# EAGLE design SRB (EAGLE 8.0.0)
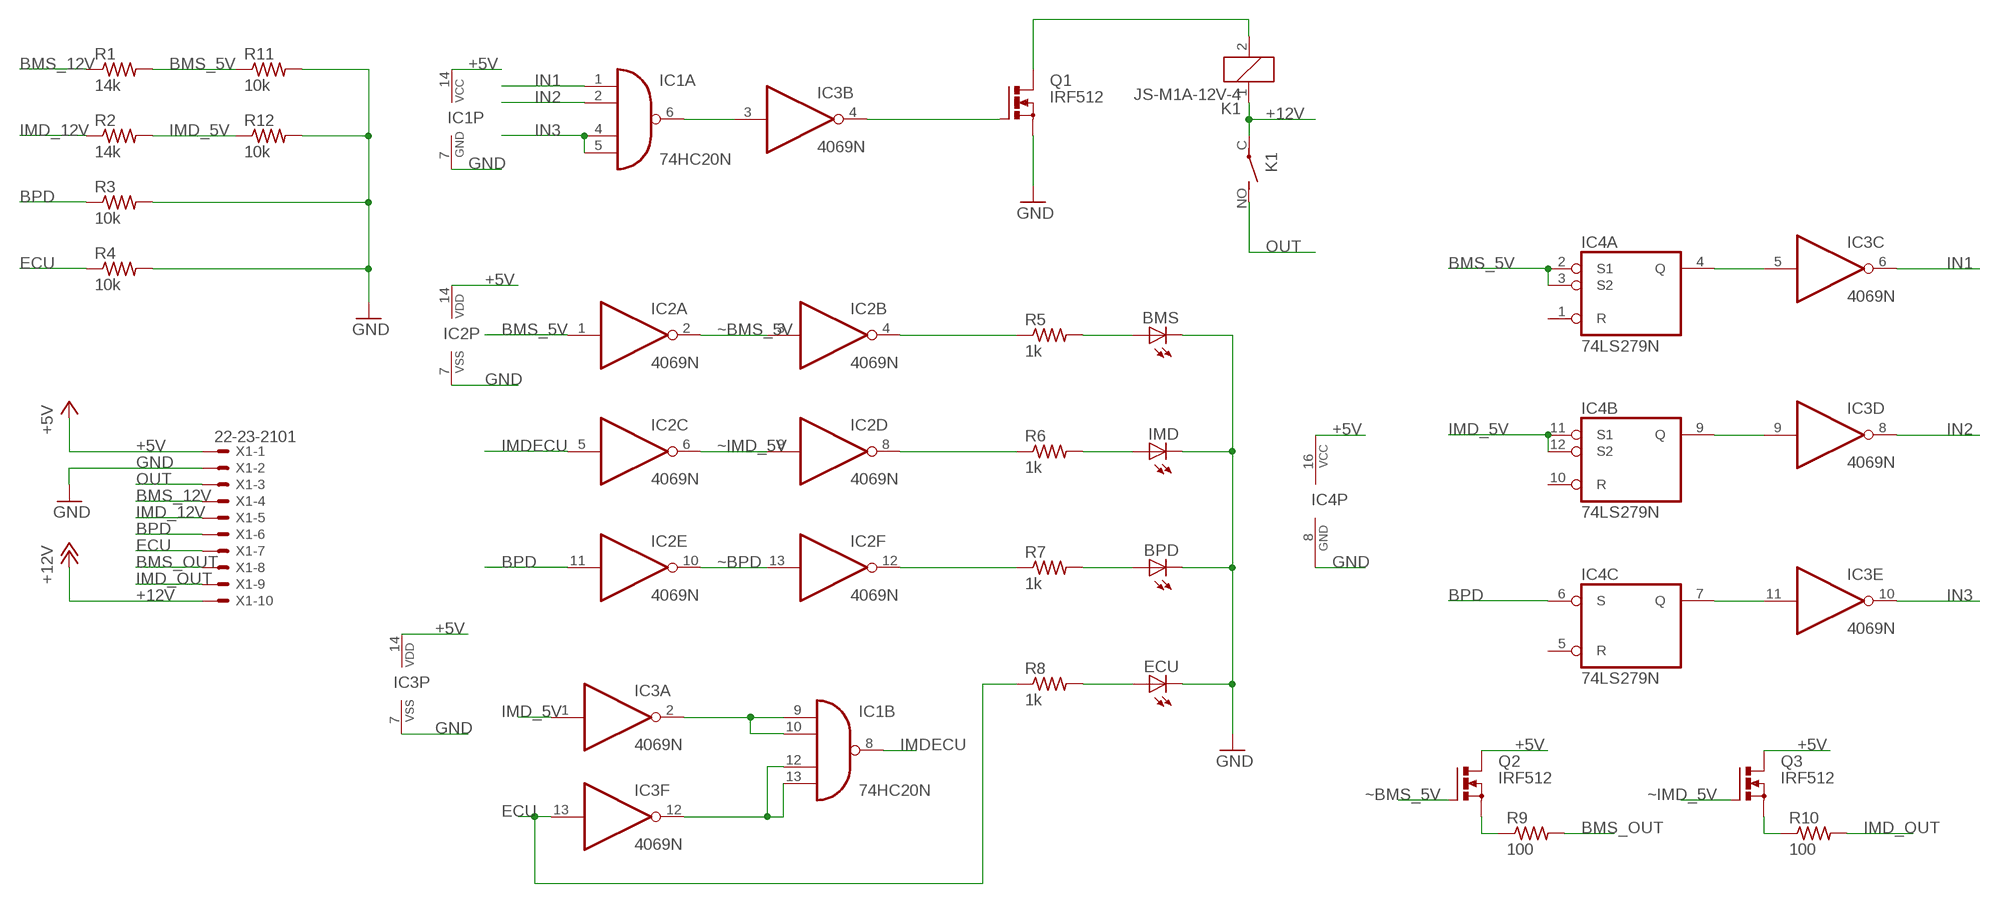
[diagram p0: schematic, sheet 1]

## Parts
BMS  LED5MM  [LED5MM]
BPD  LED5MM  [LED5MM]
ECU  LED5MM  [LED5MM]
IC1  74HC20N  [DIL14]
IC2  4069N  [DIL14]
IC3  4069N  [DIL14]
IC4  74LS279N  [DIL16]
IMD  LED5MM  [LED5MM]
K1  JS-M1A-12V-4  [JS-M1A]
Q1  IRF512  [TO220BV]
Q2  IRF512  [TO220BV]
Q3  IRF512  [TO220BV]
R1  14k  R-US_0207/10  [0207/10]
R2  14k  R-US_0207/10  [0207/10]
R3  10k  R-US_0207/10  [0207/10]
R4  10k  R-US_0207/10  [0207/10]
R5  1k  R-US_0207/10  [0207/10]
R6  1k  R-US_0207/10  [0207/10]
R7  1k  R-US_0207/10  [0207/10]
R8  1k  R-US_0207/10  [0207/10]
R9  100  R-US_0207/10  [0207/10]
R10  100  R-US_0207/10  [0207/10]
R11  10k  R-US_0207/10  [0207/10]
R12  10k  R-US_0207/10  [0207/10]
X1  22-23-2101  [22-23-2101]

## Nets
+5V: IC1.14(P:VCC) IC2.14(P:VDD) IC3.14(P:VDD) IC4.16(P:VCC) Q2.D Q3.D X1.1
+12V: K1.1 K1.C(2:P) X1.10
BMS_5V: IC2.1(A:I) IC4.2(A:S1) IC4.3(A:S2) R1.2 R11.1
BMS_12V: R1.1 X1.4
BMS_OUT: R9.2 X1.8
BPD: IC2.11(E:I) IC4.6(C:S) R3.1 X1.6
ECU: IC3.13(F:I) R4.1 R8.1 X1.7
GND: BMS.K(C) BPD.K(C) ECU.K(C) IC1.7(P:GND) IC2.7(P:VSS) IC3.7(P:VSS) IC4.8(P:GND) IMD.K(C) Q1.S R3.2 R4.2 R11.2 R12.2 X1.2
IMD_5V: IC3.1(A:I) IC4.11(B:S1) IC4.12(B:S2) R2.2 R12.1
IMD_12V: R2.1 X1.5
IMD_OUT: R10.2 X1.9
IMDECU: IC1.8(B:O) IC2.5(C:I)
IN1: IC1.1(A:I0) IC3.6(C:O)
IN2: IC1.2(A:I1) IC3.8(D:O)
IN3: IC1.4(A:I2) IC1.5(A:I3) IC3.10(E:O)
N$1: IC1.6(A:O) IC3.3(B:I)
N$2: IC3.4(B:O) Q1.G
N$3: Q2.S R9.1
N$4: IC2.4(B:O) R5.1
N$5: IC2.8(D:O) R6.1
N$6: IC2.12(F:O) R7.1
N$7: IC1.12(B:I2) IC1.13(B:I3) IC3.12(F:O)
N$10: IC1.9(B:I0) IC1.10(B:I1) IC3.2(A:O)
N$12: BMS.A R5.2
N$13: IMD.A R6.2
N$14: BPD.A R7.2
N$15: ECU.A R8.2
N$16: Q3.S R10.1
N$17: K1.2 Q1.D
N$18: IC3.5(C:I) IC4.4(A:Q)
N$19: IC3.9(D:I) IC4.9(B:Q)
N$20: IC3.11(E:I) IC4.7(C:Q)
OUT: K1.NO(2:S) X1.3
~BMS_5V: IC2.2(A:O) IC2.3(B:I) Q2.G
~BPD: IC2.10(E:O) IC2.13(F:I)
~IMD_5V: IC2.6(C:O) IC2.9(D:I) Q3.G
Unconnected: IC4.1(A:R) IC4.5(C:R) IC4.10(B:R) IC4.13(D:Q) IC4.14(D:R) IC4.15(D:S)

## Library data of the parts
BMS BPD ECU IMD = led:LED: LED OSRAM: - CHIPLED LG R971, LG N971, LY N971, LG Q971, LY Q971, LO R971, LY R971 LH N974, LH R974 LS Q976, LO Q976, LY Q976 LO Q996 - Hyper CHIPLED LW Q18S LB Q993, LB Q99A, LB R99A - SideLED LS A670, LO A670, LY A670, LG A670, LP A670 LB A673, LV A673, LT A673, LW A673 LH A674 LY A675 LS A676, LA A676, LO A676, LY A676, LW A676 LS A679, LY A679, LG A679 - Hyper Micro SIDELED® LS Y876, LA Y876, LO Y876, LY Y876 LT Y87S - SmartLED LW L88C, LW L88S LB L89C, LB L89S, LG L890 LS L89K, LO L89K, LY L89K LS L896, LA L896, LO L896, LY L896 - TOPLED LS T670, LO T670, LY T670, LG T670, LP T670 LSG T670, LSP T670, LSY T670, LOP T670, LYG T670 LG T671, LOG T671, LSG T671 LB T673, LV T673, LT T673, LW T673 LH T674 LS T676, LA T676, LO T676, LY T676, LB T676, LH T676, LSB T676, LW T676 LB T67C, LV T67C, LT T67C, LS T67K, LO T67K, LY T67K, LW E67C LS E67B, LA E67B, LO E67B, LY E67B, LB E67C, LV E67C, LT E67C LW T67C LS T679, LY T679, LG T679 LS T770, LO T770, LY T770, LG T770, LP T770 LB T773, LV T773, LT T773, LW T773 LH T774 LS E675, LA E675, LY E675, LS T675 LS T776, LA T776, LO T776, LY T776, LB T776 LHGB T686 LT T68C, LB T68C - Hyper Mini TOPLED® LB M676 - Mini TOPLED Santana® LG M470 LS M47K, LO M47K, LY M47K Source: http://www.osram.convergy.de LUXEON: - LUMILED® LXK2-PW12-R00, LXK2-PW12-S00, LXK2-PW14-U00, LXK2-PW14-V00 LXK2-PM12-R00, LXK2-PM12-S00, LXK2-PM14-U00 LXK2-PE12-Q00, LXK2-PE12-R00, LXK2-PE12-S00, LXK2-PE14-T00, LXK2-PE14-U00 LXK2-PB12-K00, LXK2-PB12-L00, LXK2-PB12-M00, LXK2-PB14-N00, LXK2-PB14-P00, LXK2-PB14-Q00 LXK2-PR12-L00, LXK2-PR12-M00, LXK2-PR14-Q00, LXK2-PR14-R00 LXK2-PD12-Q00, LXK2-PD12-R00, LXK2-PD12-S00 LXK2-PH12-R00, LXK2-PH12-S00 LXK2-PL12-P00, LXK2-PL12-Q00, LXK2-PL12-R00 Source: www.luxeon.com KINGBRIGHT: KA-3528ASYC Source: www.kingbright.com
IC1 = 74xx-eu:74*20: Dual 4-input NAND gate
IC2 IC3 = 40xx:4069: Hex INVERTER
IC4 = 74xx-us:74*279: Quadruple S-R LATCH
K1 = relay:JS-M1A*: Automotive Ultra-Miniature Power Relay NAiS Source: http://www.mew-europe.com/.. en_ds_61211_0000.pdf; MPN: JSM1A-12V-4; OC_FARNELL: unknown; OC_NEWARK: 13P4554
Q1-Q3 = transistor-power:IRF512: N-CHANNEL MOS FET
R1-R12 = resistor:R-US_: RESISTOR, American symbol
X1 = con-molex:22-23-2101: .100" (2.54mm) Center Header - 10 Pin; MF: MOLEX; MPN: 22-23-2101; OC_FARNELL: 1756828; OC_NEWARK: 94C0765

## Board
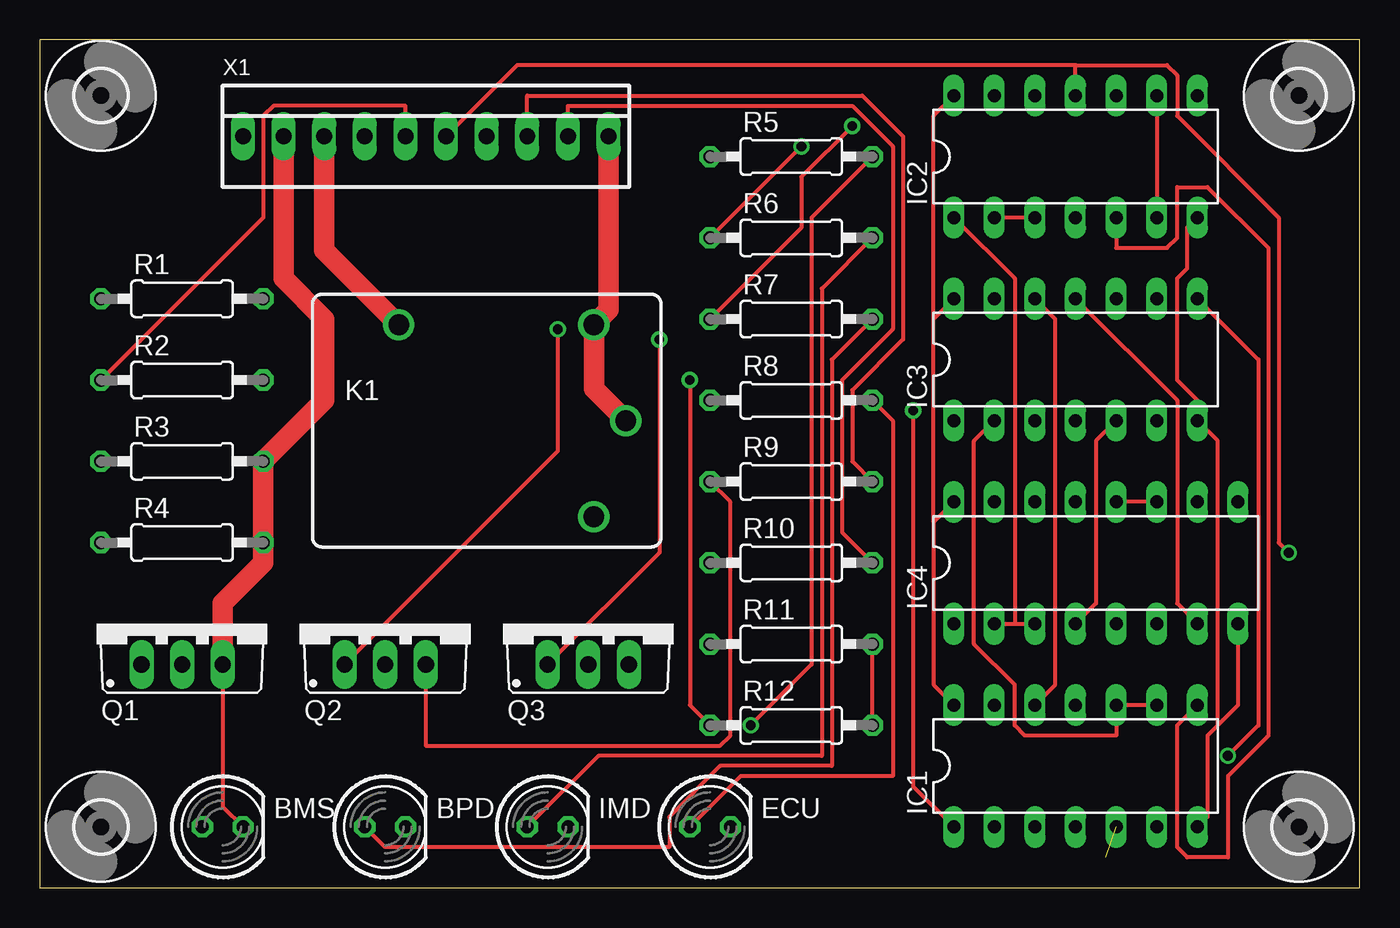
[diagram p1: board, top side]
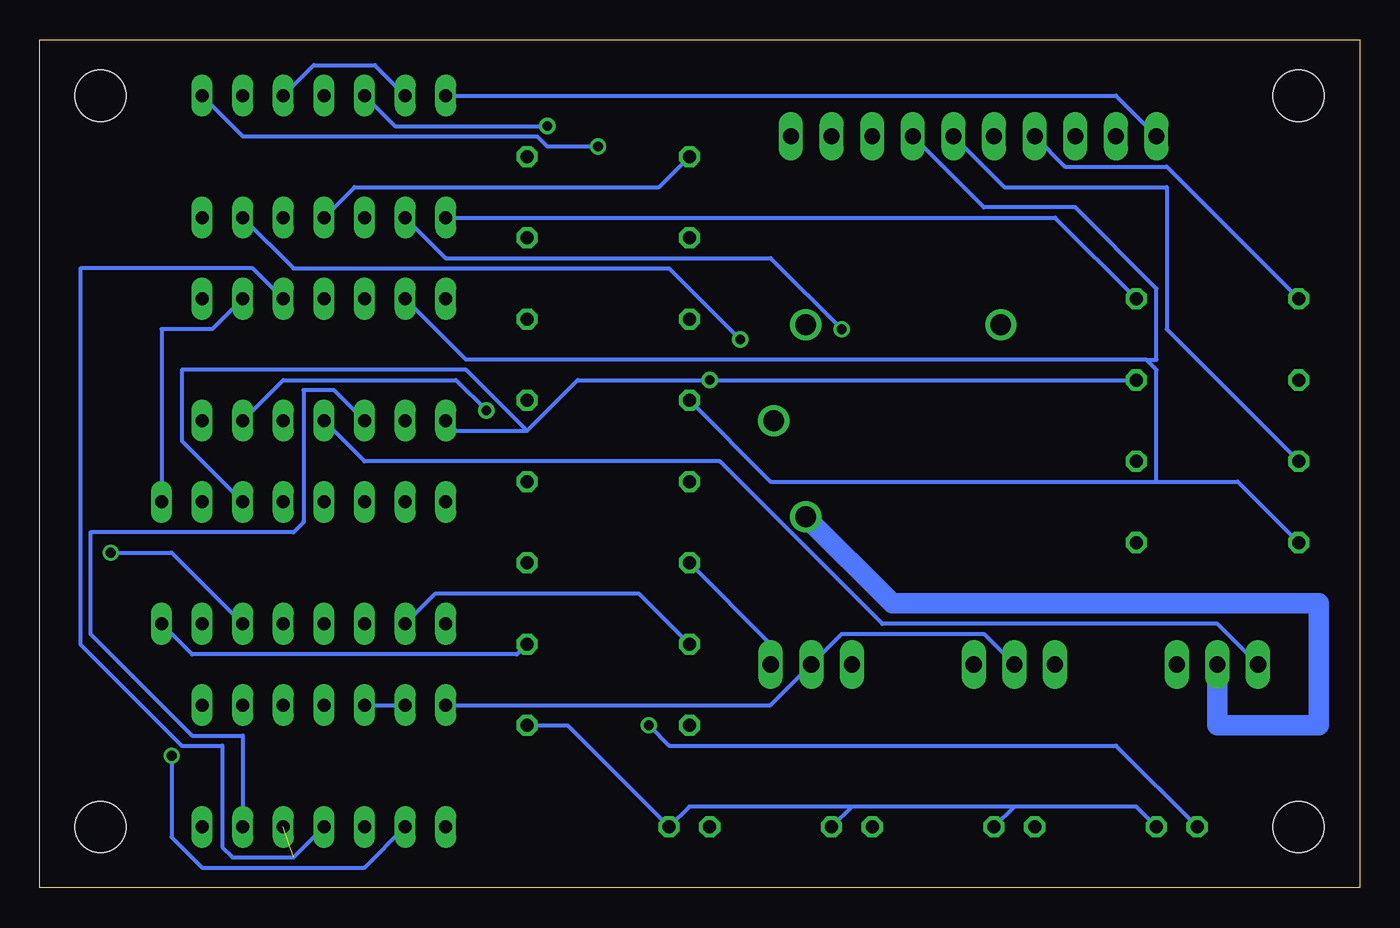
[diagram p2: board, bottom side, seen from below]

Size 82.53 x 53.01 mm. Coordinates in mm from the lower left corner, seen from the top.
Outline: 0,0 82.53,0 82.53,53.01 0,53.01 0,0
Copper layers (1*16): Top 0.035mm / dielectric 1.5mm / Bottom 0.035mm
Design rules "default": minimum track width 10mil, minimum drill 24mil, track to track 8mil, track to pad 8mil, pad to pad 8mil, via to via 8mil, smd to smd 8mil, copper to edge 40mil, drill to drill 8mil, minimum pad ring 10mil, minimum via ring 8mil, stop-mask expansion 4mil, vias tented up to drill 0mil, thermal gap 10mil

### Footprints (pad centres in the part's own frame; a part is rotated, then mirrored left to right if it is on the bottom)
LED5MM = drill 0.813 octagon: A -1.27,0; K 1.27,0
DIL14 = drill 0.813 long: 1 -7.62,-3.81; 2 -5.08,-3.81; 3 -2.54,-3.81; 4 0,-3.81; 5 2.54,-3.81; 6 5.08,-3.81; 7 7.62,-3.81; 8 7.62,3.81; 9 5.08,3.81; 10 2.54,3.81; 11 0,3.81; 12 -2.54,3.81; 13 -5.08,3.81; 14 -7.62,3.81
DIL16 = drill 0.813 long: 1 -8.89,-3.81; 2 -6.35,-3.81; 3 -3.81,-3.81; 4 -1.27,-3.81; 5 1.27,-3.81; 6 3.81,-3.81; 7 6.35,-3.81; 8 8.89,-3.81; 9 8.89,3.81; 10 6.35,3.81; 11 3.81,3.81; 12 1.27,3.81; 13 -1.27,3.81; 14 -3.81,3.81; 15 -6.35,3.81; 16 -8.89,3.81
JS-M1A = drill 1.3: 1 6.7,6; 2 6.7,-6; C 8.7,0; NO -5.5,6
TO220BV = drill 1.016 long: D 0,-2.54; G -2.54,-2.54; S 2.54,-2.54
0207/10 = drill 0.813 octagon: 1 -5.08,0; 2 5.08,0
3,2 = hole 3.2: 0,0
22-23-2101 = drill 1 long: 1 -11.43,0; 2 -8.89,0; 3 -6.35,0; 4 -3.81,0; 5 -1.27,0; 6 1.27,0; 7 3.81,0; 8 6.35,0; 9 8.89,0; 10 11.43,0

### Placement (x,y rotation side)
BMS  11.43,3.81 0 top
BPD  21.59,3.81 0 top
ECU  41.91,3.81 0 top
IC1  64.77,7.62 0 top
IC2  64.77,45.72 0 top
IC3  64.77,33.02 0 top
IC4  66.04,20.32 0 top
IMD  31.75,3.81 0 top
K1  27.94,29.21 0 top
Q1  8.89,16.51 0 top
Q2  21.59,16.51 0 top
Q3  34.29,16.51 0 top
R1  8.89,36.83 0 top
R2  8.89,31.75 0 top
R3  8.89,26.67 0 top
R4  8.89,21.59 0 top
R5  46.99,45.72 0 top
R6  46.99,40.64 0 top
R7  46.99,35.56 0 top
R8  46.99,30.48 0 top
R9  46.99,25.4 0 top
R10  46.99,20.32 0 top
R11  46.99,15.24 0 top
R12  46.99,10.16 0 top
U$1  [3,2]  3.81,3.81 0 top
U$2  [3,2]  3.81,49.53 0 top
U$3  [3,2]  78.74,49.53 0 top
U$4  [3,2]  78.74,3.81 0 top
X1  24.13,46.99 0 top

### Tracks (layer width: path | path; a pad name or v marks a point on that pad's centre or on a via)
+5V
  Top 0.254: IC1.14 55.88,12.7 55.88,22.86 | IC4.16 55.88,22.86 | 55.88,35.56 IC3.14 | 55.88,22.86 55.88,35.56 | IC2.14 55.88,48.26 55.88,35.56
  Bottom 0.254: Q2.D 23.5,15.88 32.38,15.88 Q3.D 36.83,11.43 IC1.14 | X1.1 15.24,49.53 IC2.14
+12V
  Top 1.27: X1.10 35.56,36.13 K1.1 34.64,31.21 K1.C
BMS_5V
  Top 0.254: IC4.2 60.96,16.51 | 60.96,16.51 IC4.3 | 60.96,16.51 60.96,38.1 IC2.1
  Bottom 0.254: R11.1 45.09,18.41 57.78,18.41 IC4.2 | R1.2 19.05,41.91 IC2.1
BMS_12V
  Bottom 0.254: R1.1 12.06,45.09 18.41,45.09 X1.4
BMS_OUT
  Top 0.254: R9.2 50.8,26.67 50.8,31.11 53.98,34.29 53.98,46.99 51.44,49.53 30.48,49.53 X1.8
BPD  (via drill 0.61)
  Top 0.254: v78.11,20.95 77.47,21.59 77.47,41.91 71.12,48.26 71.12,50.8 70.48,51.44 64.77,51.44 | IC2.11 64.77,51.44 | X1.6 29.84,51.44 64.77,51.44
  Bottom 0.254: R3.1 12.06,34.92 12.06,43.81 22.23,43.81 X1.6 | IC4.6 74.3,20.95 v78.11,20.95
ECU
  Bottom 0.254: R4.1 7.62,25.4 12.7,25.4 | 12.7,25.4 36.83,25.4 R8.1 | IC3.13 55.88,33.02 13.34,33.02 | 13.34,33.02 12.7,32.38 12.7,25.4 | X1.7 23.5,42.55 17.78,42.55 12.7,37.47 12.7,33.02 13.34,33.02
GND
  Top 0.254: IC1.7 73.03,4.45 73.03,9.53 73.66,10.16 | 73.66,10.16 74.93,11.43 IC4.8 | 73.66,10.16 73.66,27.94 IC3.7 72.39,30.48 71.12,31.75 71.12,38.1 71.75,38.73 71.75,41.27 IC2.7 | R12.2 R11.2 | BMS.K 11.43,5.08 Q1.S
  Top 1.27: X1.2 15.24,38.1 17.78,35.56 17.78,30.48 R3.2 R4.2 13.97,20.32 11.43,17.78 Q1.S
  Bottom 0.254: R12.2 49.53,10.16 ECU.K 41.91,5.08 31.75,5.08 | 21.59,5.08 BPD.K | 21.59,5.08 13.97,5.08 BMS.K | 31.75,5.08 IMD.K | 21.59,5.08 31.75,5.08 | IC4.8 73.03,14.61 52.7,14.61 R11.2
IMD_5V  (via drill 0.61)
  Top 0.254: IC4.11 IC4.12 | R12.1 40.64,11.43 v40.64,31.75
  Bottom 0.254: R2.2 v40.64,31.75 48.9,31.75 52.07,28.57 | 52.07,28.57 56.52,28.57 IC3.1 | IC4.11 73.66,27.94 73.66,32.38 55.88,32.38 52.07,28.57
IMD_12V
  Top 0.254: R2.1 13.97,41.91 13.97,48.26 14.61,48.9 22.86,48.9 X1.5
IMD_OUT
  Top 0.254: R10.2 50.16,22.23 50.16,31.75 53.34,34.92 53.34,46.35 50.8,48.9 33.02,48.9 X1.9
IMDECU
  Top 0.254: IC1.8 71.12,10.16 71.12,2.54 71.75,1.91 74.3,1.91 74.3,6.99 76.83,9.53 76.83,40.01 73.03,43.81 71.12,43.81 71.12,40.64 70.48,40.01 67.31,40.01 IC2.5
IN1  (via drill 0.61)
  Top 0.254: IC1.1 54.61,6.35 v54.61,29.84
  Bottom 0.254: v54.61,29.84 56.52,31.75 67.31,31.75 IC3.6
IN2  (via drill 0.61)
  Top 0.254: v74.3,8.26 76.2,10.16 76.2,33.02 IC3.8
  Bottom 0.254: IC1.2 62.23,1.27 72.39,1.27 74.3,3.17 v74.3,8.26
IN3  (1 unrouted)
  Bottom 0.254: IC1.4 66.67,1.91 70.48,1.91 71.12,2.54 71.12,8.89 73.66,8.89 80.01,15.24 80.01,38.73 69.22,38.73 IC3.10
N$1
  Bottom 0.254: IC1.6 69.85,9.53 73.03,9.53 79.38,15.88 79.38,22.23 66.67,22.23 66.04,22.86 66.04,31.11 64.14,31.11 IC3.3
N$2
  Bottom 0.254: IC3.4 62.23,26.67 40.01,26.67 29.84,16.51 8.89,16.51 Q1.G
N$3
  Top 0.254: R9.1 43.18,24.13 43.18,9.53 42.55,8.89 24.13,8.89 Q2.S
N$4
  Bottom 0.254: R5.1 43.81,43.81 62.87,43.81 IC2.4
N$5  (via drill 0.61)
  Top 0.254: v47.62,46.35 R6.1
  Bottom 0.254: v47.62,46.35 50.8,46.35 51.44,46.99 69.85,46.99 IC2.8
N$6  (via drill 0.61)
  Top 0.254: R7.1 47.62,41.27 47.62,44.45 v50.8,47.62
  Bottom 0.254: v50.8,47.62 60.33,47.62 IC2.12
N$7
  Top 0.254: IC3.12 63.5,35.56 63.5,12.7 IC1.12
  Bottom 0.254: IC1.12 IC1.13
N$10
  Top 0.254: IC1.9 IC1.10 67.31,9.53 61.59,9.53 60.96,10.16 60.96,12.7 58.42,15.24 58.42,27.94 IC3.2
N$12  (via drill 0.61)
  Top 0.254: v44.45,10.16 48.26,13.97 48.26,41.91 R5.2
  Bottom 0.254: BMS.A 15.24,8.89 43.18,8.89 v44.45,10.16
N$13
  Top 0.254: IMD.A 34.92,8.26 48.9,8.26 48.9,37.47 R6.2
N$14
  Top 0.254: BPD.A 21.59,2.54 39.37,2.54 39.37,4.45 42.55,7.62 49.53,7.62 49.53,33.02 R7.2
N$15
  Top 0.254: ECU.A 43.81,6.99 53.34,6.99 53.34,29.21 R8.2
N$16
  Bottom 0.254: R10.1 36.83,15.24 Q3.S
N$17
  Bottom 1.27: K1.2 29.21,17.78 2.54,17.78 2.54,10.16 8.89,10.16 Q1.D
N$18
  Top 0.254: IC4.4 66.04,17.78 66.04,27.94 IC3.5
N$19
  Bottom 0.254: IC4.9 74.93,34.92 71.75,34.92 IC3.9
N$20
  Top 0.254: IC4.7 71.12,17.78 71.12,30.48 IC3.11
OUT
  Top 1.27: X1.3 17.78,39.87 K1.NO
~BMS_5V  (via drill 0.61)
  Top 0.254: IC2.3 IC2.2 | Q2.G 32.38,27.3 v32.38,34.92
  Bottom 0.254: v32.38,34.92 36.83,39.37 57.15,39.37 IC2.2
~BPD
  Bottom 0.254: IC2.13 61.59,51.44 65.41,51.44 IC2.10
~IMD_5V  (via drill 0.61)
  Top 0.254: IC2.9 IC2.6 | Q3.G 38.73,20.95 v38.73,34.29
  Bottom 0.254: v38.73,34.29 43.18,38.73 66.67,38.73 IC2.6